# Altium schematic sheet OSHChip_V1.0.SchDoc
size Letter; PageSetup: Record=PageOptions|CenterHorizontal=True|CenterVertical=True|PrintScale=0.94|XCorrection=1.00|YCorrection=1.00|PrintKind=0|BorderSize=5000000|LeftOffset=0|BottomOffset=0|Orientation=2|PaperLength=1000|PaperWidth=1000|Scale=100|PaperSource=260|PrintQuality=600|MediaType=1|DitherType=10|PaperKind=Letter|PrintScaleMode=1
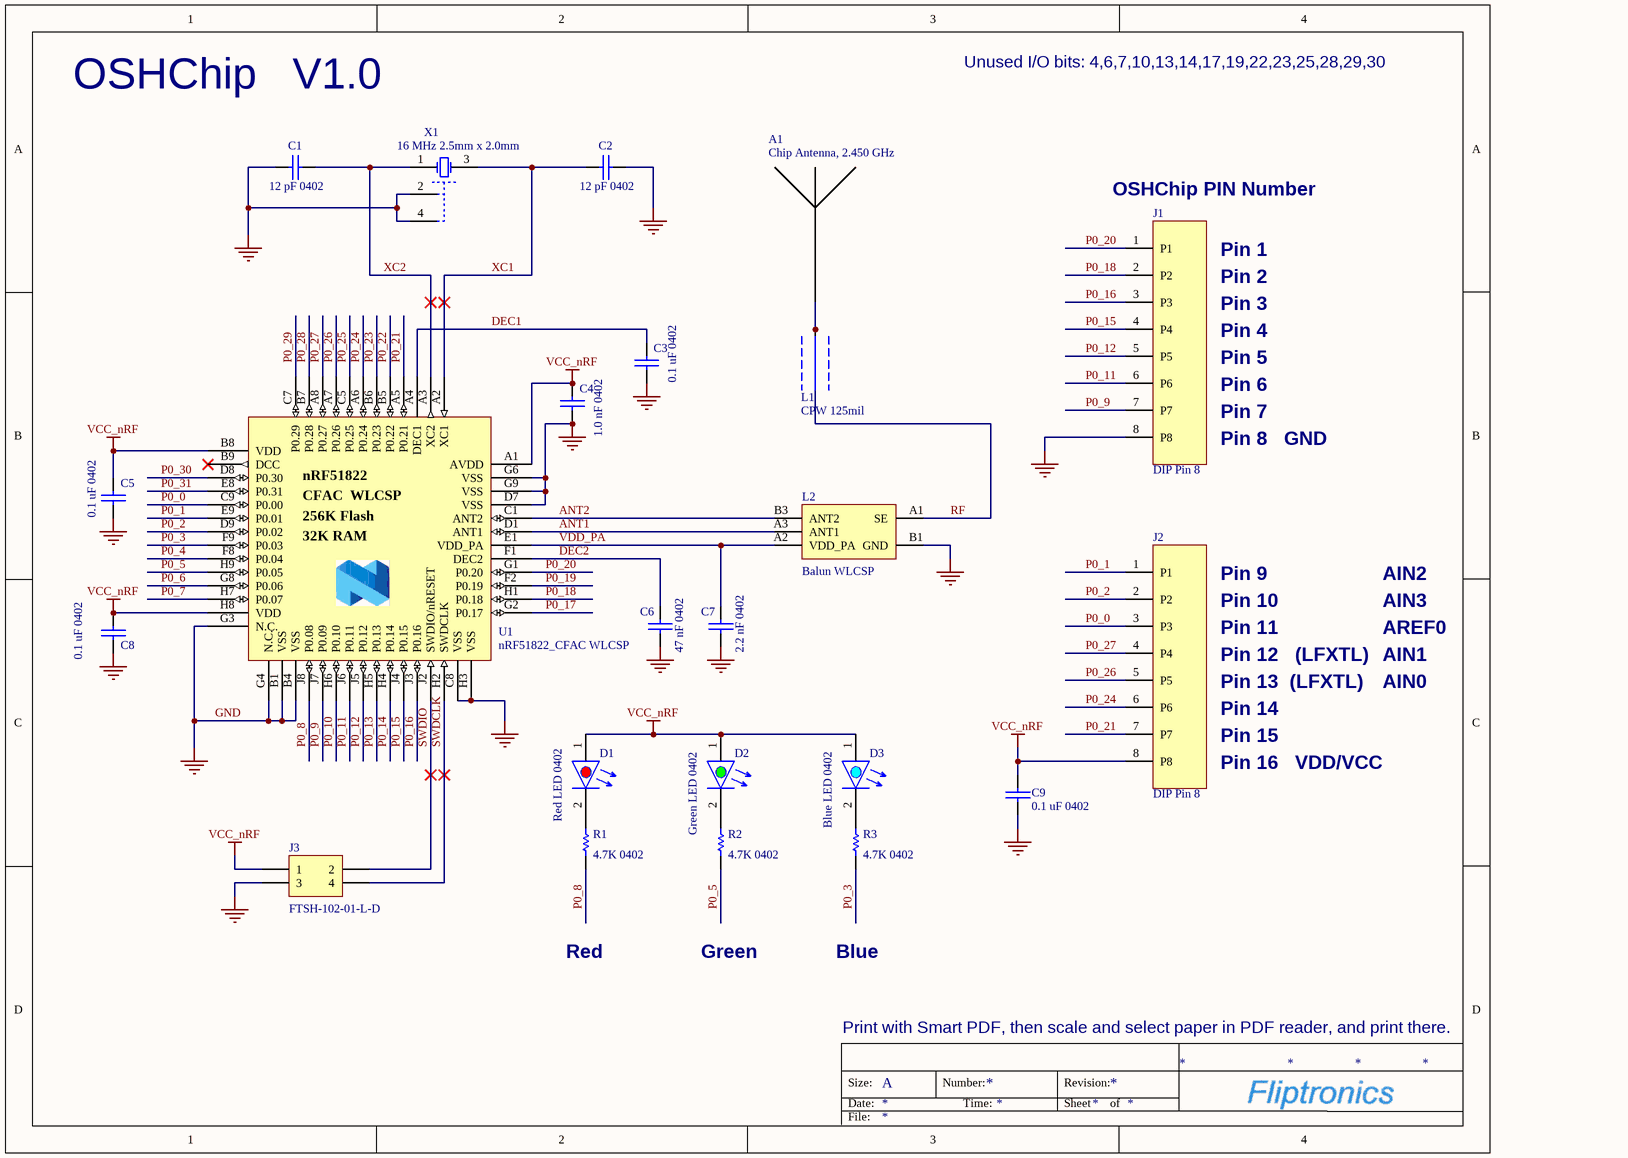
[diagram p0: OSHChip_V1.0.SchDoc]

## Parts
A1  Chip Antenna, 2.450 GHz  [AMCA31-2R450G-S1F-T]
C1  12 pF 0402  [0402 CAP RouteThru]
C2  12 pF 0402  [0402 CAP RouteThru]
C3  0.1 uF 0402  [0402 CAP RouteThru]
C4  1.0 nF 0402  [0402 CAP RouteThru]
C5  0.1 uF 0402  [0402 CAP RouteThru]
C6  47 nF 0402  [0402 CAP RouteThru]
C7  2.2 nF 0402  [0402 CAP RouteThru]
C8  0.1 uF 0402  [0402 CAP RouteThru]
C9  0.1 uF 0402  [0402 CAP RouteThru]
D1  Red LED 0402  [0402 LED Route Thru RED]
D2  Green LED 0402  [0402 LED Route Thru GREEN]
D3  Blue LED 0402  [0402 LED Route Thru BLUE]
J1  DIP Pin 8  [SIP 8    P2.54MM]
J2  DIP Pin 8  [SIP 8    P2.54MM]
J3  FTSH-102-01-L-D  [HDR_2x2_1.27mm-Through_Hole_SWD]
L1  CPW 125mil  [CPW_125]
L2  Balun WLCSP  [BAL-ST-WLCSP]
R1  4.7K 0402  [0402 Res Route Thru]
R2  4.7K 0402  [0402 Res Route Thru]
R3  4.7K 0402  [0402 Res Route Thru]
U1  nRF51822_CFAC WLCSP  [BGA62C40P9X9_383X383X55]
X1  16 MHz 2.5mm x 2.0mm  [BT-XTAL_2520]

## Nets
GND: C1.1 C2.2 C3.1 C4.1 C5.1 C6.1 C7.1 C8.1 C9.1 J1.8(P8) J3.3 L2.B1(GND) U1.B1(VSS) U1.B4(VSS) U1.C8(VSS) U1.D7(VSS) U1.G3(N.C.) U1.G4(N.C.) U1.G6(VSS) U1.G9(VSS) U1.H3(VSS) X1.2(nc_2) X1.4(nc_4)
VCC_nRF: C4.2 C5.2 C8.2 C9.2 D1.1 D2.1 D3.1 J2.8(P8) J3.1 U1.A1(AVDD) U1.B8(VDD) U1.H8(VDD)
ANT1: L2.A3(ANT1) U1.D1(ANT1)
ANT2: L2.B3(ANT2) U1.C1(ANT2)
DEC1: C3.2 U1.A4(DEC1)
DEC2: C6.2 U1.F1(DEC2)
P0_0: J2.3(P3) U1.C9(P0.00)
P0_1: J2.1(P1) U1.E9(P0.01)
P0_2: J2.2(P2) U1.D9(P0.02)
P0_3: R3.1 U1.F9(P0.03)
P0_4: U1.F8(P0.04)
P0_5: R2.1 U1.H9(P0.05)
P0_6: U1.G8(P0.06)
P0_7: U1.H7(P0.07)
P0_8: R1.1 U1.J8(P0.08)
P0_9: J1.7(P7) U1.J7(P0.09)
P0_10: U1.H6(P0.10)
P0_11: J1.6(P6) U1.J6(P0.11)
P0_12: J1.5(P5) U1.J5(P0.12)
P0_13: U1.H5(P0.13)
P0_14: U1.H4(P0.14)
P0_15: J1.4(P4) U1.J4(P0.15)
P0_16: J1.3(P3) U1.J3(P0.16)
P0_17: U1.G2(P0.17)
P0_18: J1.2(P2) U1.H1(P0.18)
P0_19: U1.F2(P0.19)
P0_20: J1.1(P1) U1.G1(P0.20)
P0_21: J2.7(P7) U1.A5(P0.21)
P0_22: U1.B5(P0.22)
P0_23: U1.B6(P0.23)
P0_24: J2.6(P6) U1.A6(P0.24)
P0_25: U1.C5(P0.25)
P0_26: J2.5(P5) U1.A7(P0.26)
P0_27: J2.4(P4) U1.A8(P0.27)
P0_28: U1.B7(P0.28)
P0_29: U1.C7(P0.29)
P0_30: U1.D8(P0.30)
P0_31: U1.E8(P0.31)
RF: A1.1 L1.1 L2.A1(SE)
SWDCLK: J3.4 U1.H2(SWDCLK)
SWDIO: J3.2 U1.J2(SWDIO/nRESET)
VDD_PA: C7.2 L2.A2(VDD_PA) U1.E1(VDD_PA)
XC1: C2.1 U1.A2(XC1) X1.3(OSC2)
XC2: C1.2 U1.A3(XC2) X1.1(OSC1)
NetD1_2: D1.2 R1.2
NetD2_2: D2.2 R2.2
NetD3_2: D3.2 R3.2

Not connected (* = marked no-connect by the designer): U1 B9(DCC)*

## Notes on the sheet
- OSHChip   V1.0
- Unused I/O bits: 4,6,7,10,13,14,17,19,22,23,25,28,29,30
- (near J1) OSHChip PIN Number
- Pin 1
- Pin 2
- Pin 3
- Pin 4
- Pin 5
- Pin 6
- Pin 7
- Pin 8   GND
- Pin 9
- Pin 10
- Pin 11
- AIN2
- AIN3
- AREF0
- Pin 12   (LFXTL)
- Pin 13  (LFXTL)
- AIN1
- AIN0
- Pin 14
- Pin 15
- Pin 16   VDD/VCC
- Red
- Green
- Blue
- Print with Smart PDF, then scale and select paper in PDF reader, and print there.
- Size:
- Date:
- A
- Number:
- Time:
- Revision:
- Sheet
- of
- File:
- (in symbol U nRF51822_CFAC WLCSP, 256KB Flash, 32KB RAM) nRF51822; CFAC  WLCSP; 256K Flash; 32K RAM

## Library data of the parts
A1 = A 2.4_GHZ Abracon Chip Antenna_1: Chip Antenna 2.4 GHz; LatestRevisionDate: 06/28/2015; LatestRevisionNote: Created by PMF; Supplier 1: Mouser; Supplier Part Number 1: 815-CA312R450GS1FT; Supplier 2: Digi-Key; Supplier Part Number 2: 535-12386-1-ND; Part Number: AMCA31-2R450G-S1F-T
C1 C2 = C 12 pF 0402  50V  NP0  5%: Capacitor 12 pF 0402  50V  NP0  5%; Part Number: CL05C120JB5NNNC; BOM Notes: 1K in stock, Avnet Express, 10,000 reel GRM1555C1H120JA01D   $19.00; LatestRevisionDate: 06/29/2015; LatestRevisionNote: Created by PMF; Supplier 1: Digi-Key; Supplier Part Number 1: 1276-1178-1-ND; Supplier 2: Newark; Supplier Part Number 2: 06R4778
C3 C5 C8 C9 = C 0.1 uF 0402  10 V  X5R 10%: Capacitor 0.1 uF 0402  10 V  X5R 10%; Part Number: CL05B104KO5NNNC; BOM Notes: 1500 stock,  Avnet Express, 10,000 reel CL05B104KO5NNNC   $10.00; LatestRevisionDate: 06/29/2015; LatestRevisionNote: Created by PMF; Supplier 1: Digi-Key; Supplier Part Number 1: 1276-1001-1-ND; Supplier 2: Newark; Supplier Part Number 2: 90R7598
C4 = C 1.0 nF 0402 25 V X7R  10%: Capacitor 1.0 nF 0402 25 V X7R  10%; Part Number: 04025C102KAT2A; BOM Notes: Stock is 5000 + 1000 of 478-1101-1-ND; LatestRevisionDate: 06/29/2015; LatestRevisionNote: Created by PMF; Supplier 1: Newark; Supplier Part Number 1: 06R4614; Supplier 2: Digi-Key; Supplier Part Number 2: 478-1101-1-ND
C6 = C 47 nF 0402  16V  X7R  10%: Capacitor 47 nF 0402  16V  X7R  10%; Part Number: EMK105B7473KV-F; BOM Notes: 1K pcs in stock; LatestRevisionDate: 06/29/2015; LatestRevisionNote: Created by PMF; Supplier 1: Digi-Key; Supplier Part Number 1: 587-1225-1-ND; Supplier 2: Mouser; Supplier Part Number 2: 963-EMK105B7473KV-F
C7 = C 2.2 nF 0402  50 V X7R  10%: Capacitor 2.2 nF 0402  50 V X7R  10%; Part Number: CC0402KRX7R9BB222; BOM Notes: Stock on hand 1780; LatestRevisionDate: 06/29/2015; LatestRevisionNote: Created by PMF; Supplier 1: Digi-Key; Supplier Part Number 1: 311-1037-1-ND; Supplier 2: Newark; Supplier Part Number 2: 65R7712
D1 = D LED APHHS1005SURCK: LED Red 630 nm  0402; BOM Notes: 85 pcs stock on hand + 250; LatestRevisionDate: 06/29/2015; LatestRevisionNote: Created by PMF; Supplier 1: Mouser; Supplier Part Number 1: 604-APHHS1005SURCK; Supplier 2: Digi-Key; Supplier Part Number 2: 754-1104-1-ND; Part Number: APHHS1005SURCK
D2 = D LED APHHS1005CGCK Green 570nm  0402: LED APHHS1005CGCK Green 570nm  0402; LatestRevisionDate: 06/29/2015; LatestRevisionNote: Created by PMF; BOM Notes: *; Supplier 1: Mouser; Supplier Part Number 1: 604-APHHS1005CGCK; Supplier 2: Digi-Key; Supplier Part Number 2: 754-1101-1-ND; Part Number: APHHS1005CGCK
D3 = D LED LB QH9G-N1P2-35-1: LED Blue 466 nm  0402; LatestRevisionDate: 06/29/2015; LatestRevisionNote: Created by PMF; BOM Notes: *; Supplier 1: Mouser; Supplier Part Number 1: 720-LBQH9G-N1P2-35-1; Supplier 2: Digi-Key; Supplier Part Number 2: 475-3112-1-ND; Part Number: LB QH9G-N1P2-35-1
J1 J2 = J DIP Pin 8 Etched: DIP Pin 8 Etched; Part Number: OSHChip_Pin_8; LatestRevisionDate: 06/29/2015; LatestRevisionNote: Created by PMF; Supplier 1: Fliptronics; Supplier Part Number 1: OSHChip_Pin_8; Supplier Unit Price 1: 0.57
J3 = J Header 2X2 J-Link Lite: BOM Notes: Buy direct from Samtec, $0.563; LatestRevisionDate: 06/29/2015; LatestRevisionNote: Created by PMF; Supplier 1: Newark; Supplier Part Number 1: 01R3028; Part Number: FTSH-102-01-L-D
L1 = L CPW 125mil: CPW 125mil , over ground plane, .062 board, 50 Ohm; BOM Notes: $0.00 cast, part of PCB layout; LatestRevisionDate: 06/29/2015; LatestRevisionNote: Created by PMF; Supplier 1: Fliptronics; Supplier Part Number 1: CPW-125mil; Part Number: CPW 125mil; Supplier Unit Price 1: 0.0
L2 = L BAL-NRF02D3 nRF51822 Balun 50 ohm for 2.45GHz: Balun matched to WLCSP nRF61822; LatestRevisionDate: 06/29/2015; LatestRevisionNote: Created by PMF; BOM Notes: *; Supplier 1: Mouser; Supplier Part Number 1: 511-BAL-NRF02D3; Supplier 2: Digi-Key; Supplier Part Number 2: 497-14009-1-ND; Part Number: BAL-NRF02D3
R1-R3 = R 4.7K 0402 1/16 W 1%: Resistor 4.7K 0402 1/16 W 1%; Part Number: RC0402FR-074K7L; BOM Notes: Cheapest price is Mouser 10K reel RC0402FR-074K7L @ $10.00; LatestRevisionDate: 06/29/2015; LatestRevisionNote: Created by PMF; Supplier 1: Mouser; Supplier Part Number 1: 603-AC0402FR-074K7L; Supplier 2: Digi-Key; Supplier Part Number 2: 311-4.7KLRCT-ND
U1 = U nRF51822_CFAC WLCSP, 256KB Flash, 32KB RAM: Multi-protocol Bluetooth Low Energy and 2.4GHz proprietary system-on-chip; BOM Notes: Semiconductor store is $2.62 or $2.72 for ANT+; LatestRevisionDate: 06/29/2015; LatestRevisionNote: Created by PMF; Supplier 1: Digi-Key; Supplier Part Number 1: 1490-1041-1-ND; Part Number: nRF51822_CFAC
X1 = X 16MHz Xtal, 2.5mmx2.0mm, 10ppm,  8 pF: 16MHz Xtal, 2.5mmx2.0mm, 10ppm,  8 pF; Part Number: FA-20H; BOM Notes: Check who has best price at order qty.; LatestRevisionDate: 06/29/2015; LatestRevisionNote: Created by PMF; Supplier 1: Digi-Key; Supplier Part Number 1: SER3913CT-ND; Supplier 2: Mouser; Supplier Part Number 2: 732-FA-20H16F12V-AJ3